# Altium schematic sheet 3V3_Buck_For_Auton_LED.SchDoc
size 259 x 167 mm; SheetNumber: 2; SheetTotal: 15
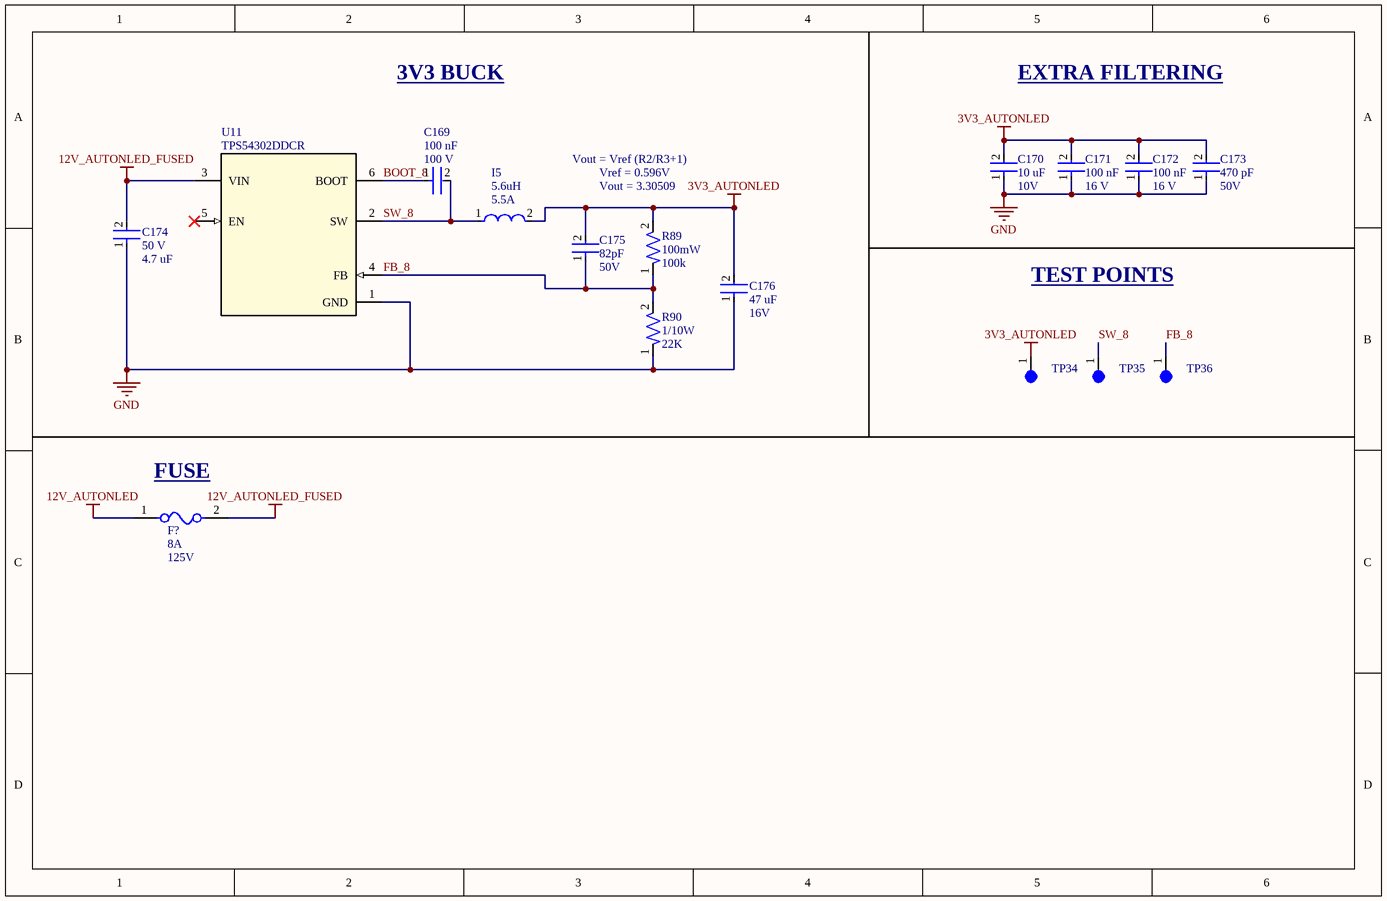
[diagram p0: 3V3_Buck_For_Auton_LED.SchDoc]

## Parts
C169  Capacitance: 100 nF  Voltage: 100 V  [CAP-0603]  (hidden comment: CC0603KRX7R0BB104)
C170  Voltage: 10V  Capacitance: 10 uF  [CAP-0603]  (hidden comment: CC0603KRX5R6BB106)
C171  Voltage Rating: 16 V  Capacitance: 100 nF  [CAP-0402]  (hidden comment: CC0402KRX7R7BB104)
C172  Voltage Rating: 16 V  Capacitance: 100 nF  [CAP-0402]  (hidden comment: CC0402KRX7R7BB104)
C173  Voltage: 50V  Capacitance: 470 pF  [CAP-0805]  (hidden comment: CC0805JRNPO9BN471)
C174  Voltage: 50 V  Capacitance: 4.7 uF  [CAP-0805]  (hidden comment: CC0805KKX5R9BB475)
C175  Voltage: 50V  Capacitance: 82pF  [CAP-0805]  (hidden comment: CC0805JRNPO9BN820)
C176  Capacitance: 47 uF  Voltage: 16V  [CAP-1210]  (hidden comment: GRM32ER61C476KE15L)
F?  Fuse Current: 8A  Voltage Rating: 125V  [FUSE-0001]  (hidden comment: 01550900M)
I5  Saturation Current: 5.5A  Inductance: 5.6uH  [IND_SRP6540-5R6M]  (hidden comment: SRP6540-5R6M)
R89  Power: 100mW  Resistance: 100k  [RES-0603]  (hidden comment: RC0603FR-07100KL)
R90  Power: 1/10W  Resistance: 22K  [RES-0603]  (hidden comment: RC0603FR-0722KL)
TP34  5003  [TEST-POINT-0001]  (value not drawn)
TP35  5003  [TEST-POINT-0001]  (value not drawn)
TP36  5003  [TEST-POINT-0001]  (value not drawn)
U11  TPS54302DDCR  [IC-SOT-23-6]

## Nets
3V3_AUTONLED: C170.2 C171.2 C172.2 C173.2 C175.2 C176.2 I5.2 R89.2 TP34.1
12V_AUTONLED: F?.1
12V_AUTONLED_FUSED: C174.2 F?.2 U11.3(VIN)
GND: C170.1 C171.1 C172.1 C173.1 C174.1 C176.1 R90.1 U11.1(GND)
BOOT_8: C169.1 U11.6(BOOT)
FB_8: C175.1 R89.1 R90.2 TP36.1 U11.4(FB)
SW_8: C169.2 I5.1 TP35.1 U11.2(SW)

Not connected (* = marked no-connect by the designer): U11 5(EN)*

## Notes on the sheet
- 3V3 BUCK
- EXTRA FILTERING
- Vout = Vref (R2/R3+1)
- Vref = 0.596V
- Vout = 3.30509
- TEST POINTS
- (near F?) FUSE

## Library data of the parts
C169 = CAP-100N-0001: CAP CER 0.1UF 100V X7R 0603; Device Class: Ceramic; Size: 0603; ComponentLink1Description: Datasheet; ComponentLink1URL: https://www.yageo.com/upload/media/product/app/datasheet/mlcc/upy-np0x7r_mv_100-to-630v.pdf
C170 = CAP-10U-0001: CAP CER 10UF 10V X5R 0603; ComponentLink1Description: Datasheet; ComponentLink1URL: https://www.yageo.com/upload/media/product/app/datasheet/mlcc/upy-gphc_x5r_4v-to-50v.pdf; Device Class: Ceramic; Size: 0603
C171 C172 = CAP-0.1U-0001: CAP CER 0.1UF 16V X7R 0402; ComponentLink2Description: Datasheet; ComponentLink2URL: https://www.yageo.com/upload/media/product/productsearch/datasheet/mlcc/UPY-GPHC_X7R_6.3V-to-250V_24.pdf; Device Class: Ceramic; Size: 0402
C173 = CAP-470P-0001: CAP CER 470PF 50V C0G/NPO 0805; Device Class: Ceramic; Size: 0805; ComponentLink1Description: Datasheet; ComponentLink1URL: https://www.yageo.com/upload/media/product/productsearch/datasheet/mlcc/UPY-GP_NP0_16V-to-50V_18.pdf
C174 = CAP-4.7U-0002: CAP CER 4.7UF 50V X5R 0805; ComponentLink2Description: Datasheet; ComponentLink2URL: http://www.yageo.com/documents/recent/UPY-GPHC_Y5V_6.3V-to-50V_8.pdf; Device Class: Ceramic; Size: 0805
C175 = CAP-82P-0001: 82 pF ±5% 50V Ceramic Capacitor C0G, NP0 0805 (2012 Metric)
C176 = CAP-47U-0002: CAP CER 47UF 16V X5R 1210; Device Class: Ceramic; Size: 1210; ComponentLink1Description: Datasheet; ComponentLink1URL: https://search.murata.co.jp/Ceramy/image/img/A01X/G101/ENG/GRM32ER61C476KE15-01.pdf
F? = FUSE-0001: FUSE BLOK CARTRIDGE 125V 10A SMD; ComponentLink2Description: Datasheet; ComponentLink2URL: https://www.littelfuse.com/~/media/electronics/datasheets/fuses/littelfuse_fuse_154_154t_154l_154tl_datasheet.pdf.pdf
I5 = IND-5.6U-0002: FIXED IND 5.6UH 5.5A 38 MOHM SMD
R89 = RES-100k-0001: RES SMD 100K OHM 1% 1/10W 0603; Tolerance: 1%; Size: 0603; ComponentLink1Description: Datasheet; ComponentLink1URL: https://www.yageo.com/upload/media/product/products/datasheet/rchip/PYu-RC_Group_51_RoHS_L_12.pdf
R90 = RES-22k-0001: 22 kOhms ±1% 0.1W, 1/10W Chip Resistor 0603 (1608 Metric) Moisture Resistant Thick Film; Parameter 1: *
TP34-TP36 = TEST-POINT-0001: Oranange PC Test Point, Miniature Phoisphor Bronze Silver Plating Through Hole Mounting Type
U11 = IC-BUCK-0004: IC REG BUCK ADJ 3A SOT23